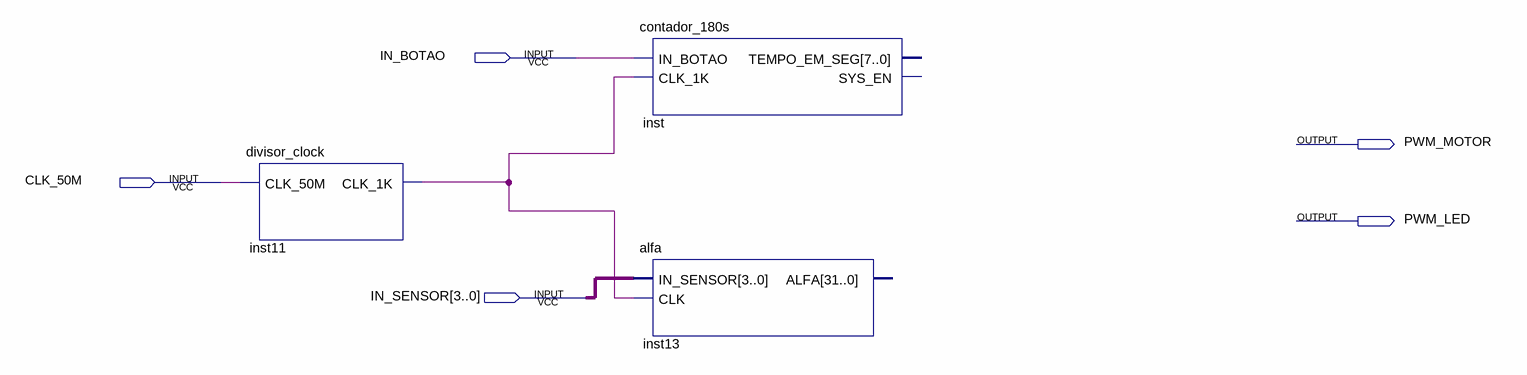
[diagram p0: schematic sheet]
// Quartus schematic projetoU3.bdf as structural Verilog: 3 symbols, 5 pins
module projetoU3 (
  input  IN_BOTAO,
  input  CLK_50M,
  input  [3:0] IN_SENSOR,
  output PWM_MOTOR,
  output PWM_LED
);

  wire inst11_clk_1k;

  divisor_clock inst11 (.CLK_50M(CLK_50M), .CLK_1K(inst11_clk_1k));
  contador_180s inst (.IN_BOTAO(IN_BOTAO), .CLK_1K(inst11_clk_1k));  // open: TEMPO_EM_SEG, SYS_EN
  alfa inst13 (.IN_SENSOR(IN_SENSOR), .CLK(inst11_clk_1k));  // open: ALFA
endmodule
